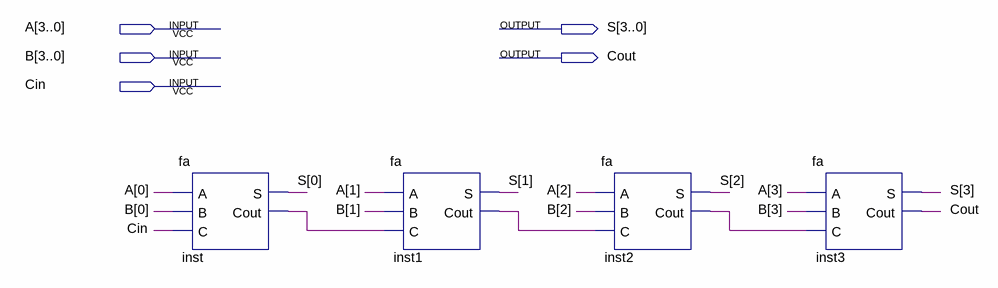
[diagram p0: schematic sheet]
// Quartus schematic sum4.bdf as structural Verilog: 4 symbols, 5 pins
module sum4 (
  input  [3:0] A,
  input  [3:0] B,
  input  Cin,
  output [3:0] S,
  output Cout
);

  wire inst1_cout, inst2_cout, inst_cout;

  fa inst (.A(A[0]), .B(B[0]), .C(Cin), .S(S[0]), .Cout(inst_cout));
  fa inst1 (.A(A[1]), .B(B[1]), .C(inst_cout), .S(S[1]), .Cout(inst1_cout));
  fa inst2 (.A(A[2]), .B(B[2]), .C(inst1_cout), .S(S[2]), .Cout(inst2_cout));
  fa inst3 (.A(A[3]), .B(B[3]), .C(inst2_cout), .S(S[3]), .Cout(Cout));
endmodule
